# Altium schematic sheet Converter_Unit.SchDoc
size A3
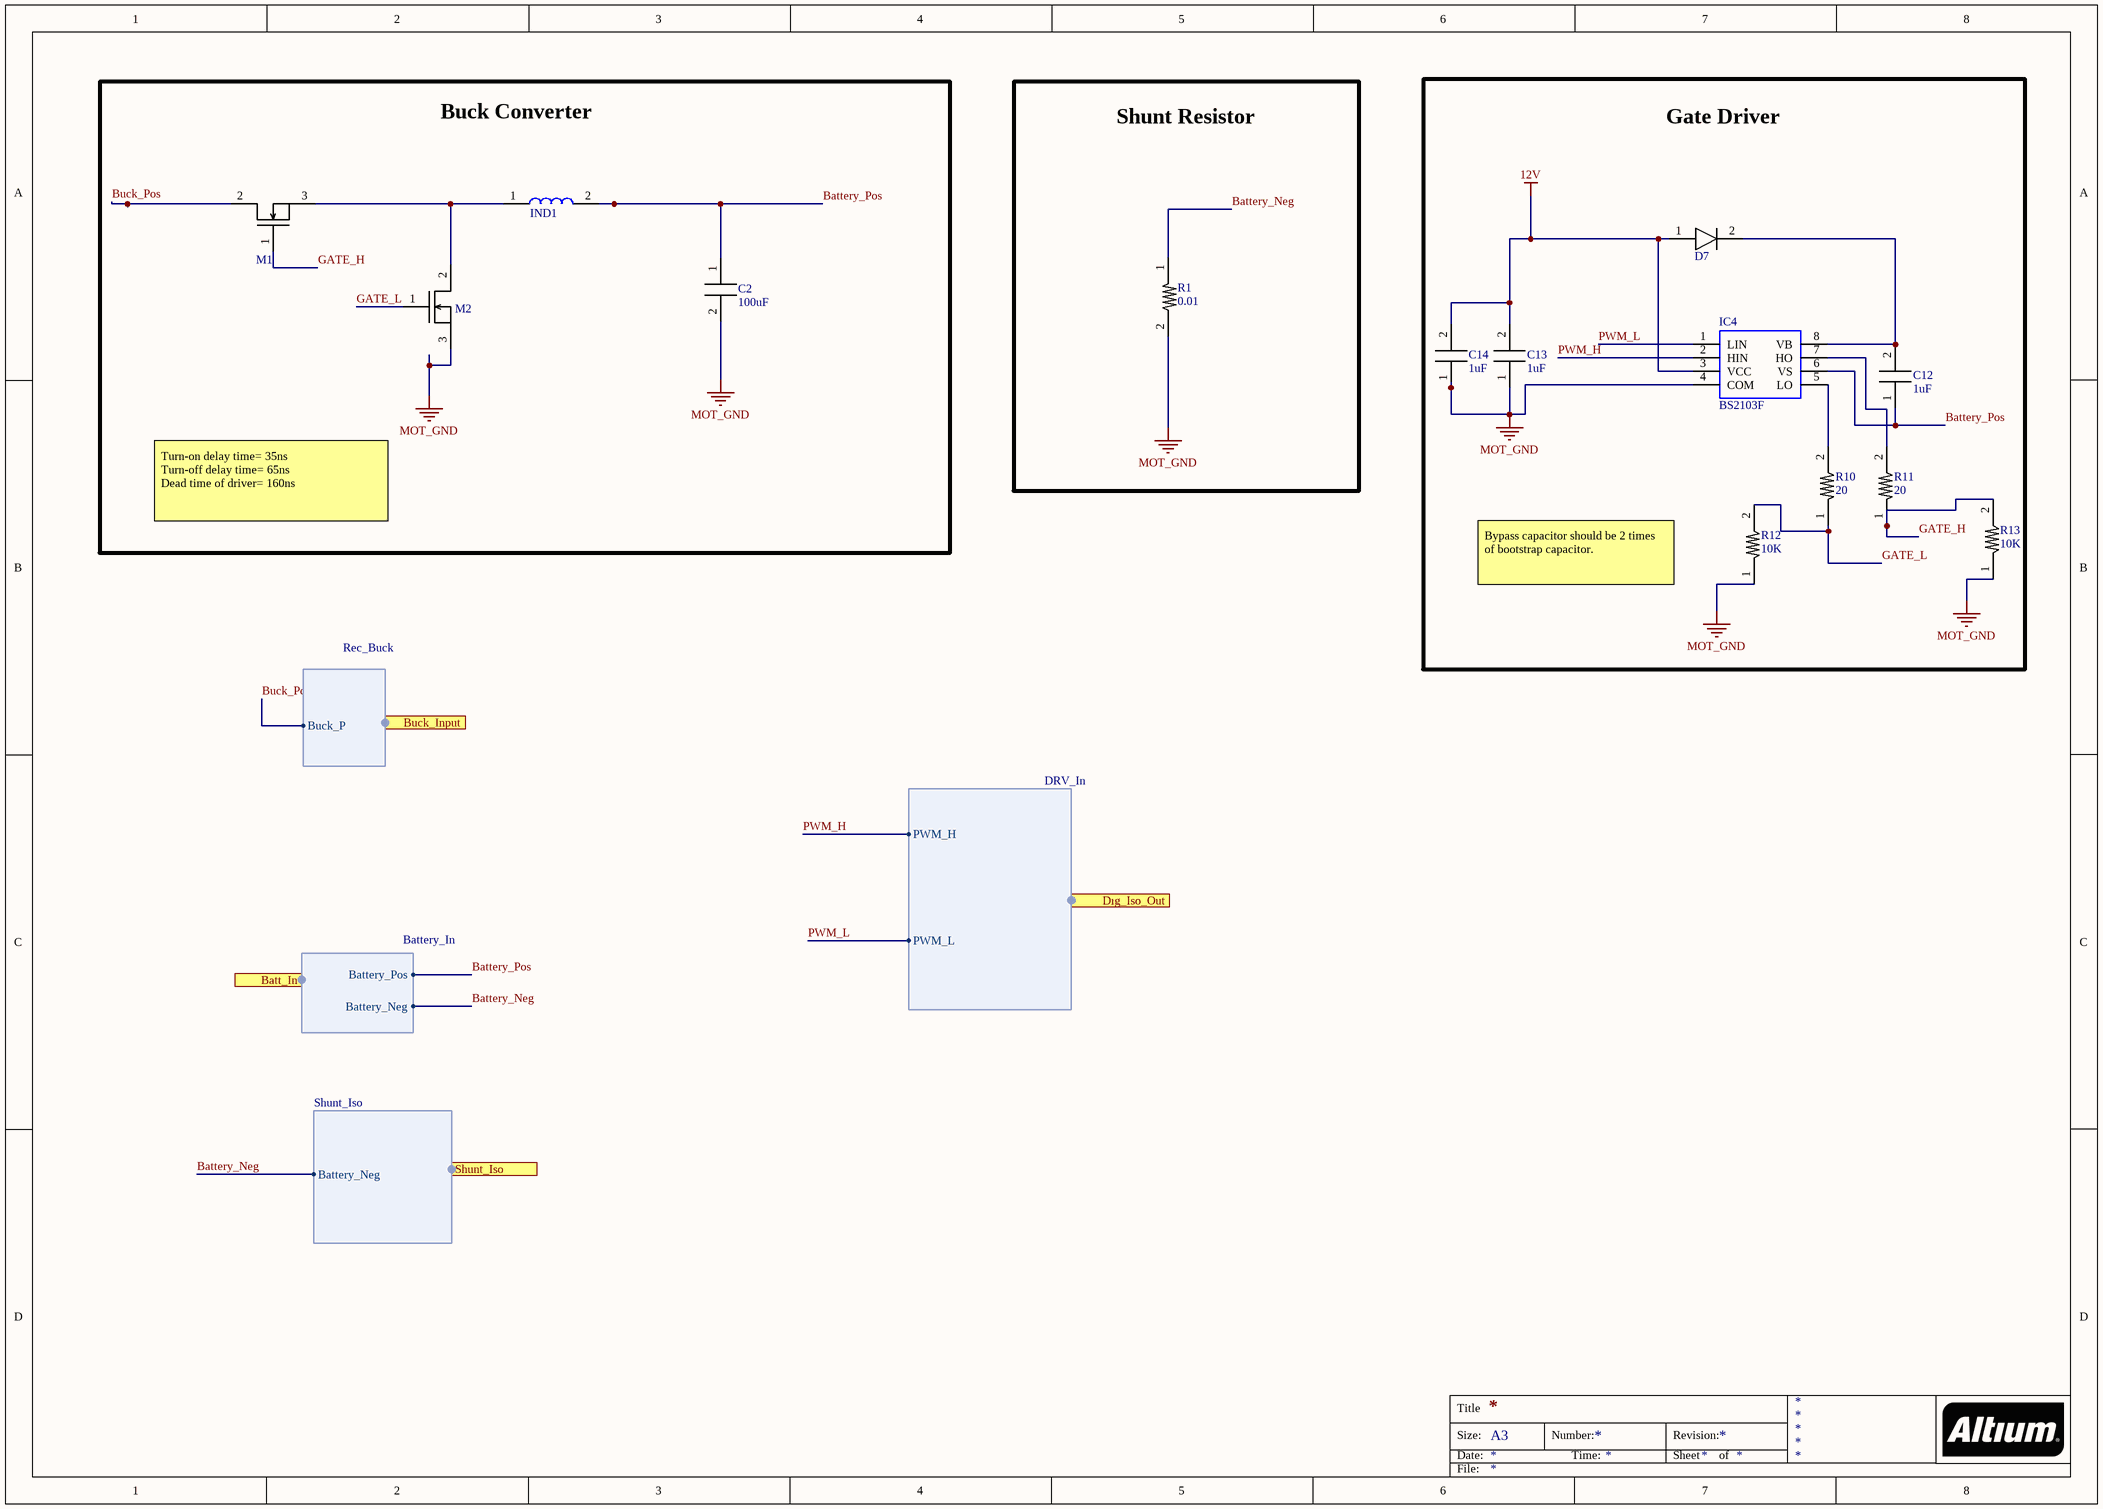
[diagram p0: Converter_Unit.SchDoc]

## Parts
C2  Parameter 1: 100uF  [860020573008]  (hidden comment: CAP 100uF 860020573008)
C12  Parameter 1: 1uF  [0603_CAP]  (hidden comment: CAP 1uF)
C13  Parameter 1: 1uF  [0603_CAP]  (hidden comment: CAP 1uF)
C14  Parameter 1: 1uF  [0603_CAP]  (hidden comment: CAP 1uF)
D7  DI S2GTR  [S2GTR]  (value not drawn)
IC4  BS2103F  [BS2103F]
IND1  IND, 1mH, B82615B2202M001  [AIRD]  (value not drawn)
M1  M?  [FDD5N50NZ]  (value not drawn)
M2  M?  [FDD5N50NZ]  (value not drawn)
R1  Parameter 1: 0.01  [RES_0402]  (hidden comment: RES, 0.01, 0402, Shunt)
R10  Parameter 1: 20  [0603_RES]  (hidden comment: RES, 20, 0603)
R11  Parameter 1: 20  [0603_RES]  (hidden comment: RES, 20, 0603)
R12  Parameter 1: 10K  [0603_RES]  (hidden comment: RES, 10K, 0603)
R13  Parameter 1: 10K  [0603_RES]  (hidden comment: RES, 10K, 0603)

## Ports
Batt_In (harness Battery_In), Buck_Input (harness Rec_Buck), Dıg_Iso_Out (harness DRV_In), Shunt_Iso (harness Shunt_Iso)

## Harnesses
Battery_In: Battery_Pos, Battery_Neg
DRV_In: PWM_H, PWM_L
Shunt_Iso: Battery_Neg
Rec_Buck: Buck_P

## Nets
12V: C13.2 C14.2 D7.1(Anode) IC4.3(VCC)
MOT_GND: C2.2 C13.1 C14.1 IC4.4(COM) M2.3 R1.2 R12.1 R13.1
Battery_Neg: R1.1 ; port Batt_In.Battery_Neg, port Shunt_Iso.Battery_Neg
Battery_Pos: C2.1 C12.1 IC4.6(VS) IND1.2 ; port Batt_In.Battery_Pos
Buck_Pos: M1.2 ; port Buck_Input.Buck_P
GATE_H: M1.1 R11.1 R13.2
GATE_L: M2.1 R10.1 R12.2
PWM_H: IC4.2(HIN) ; port Dıg_Iso_Out.PWM_H
PWM_L: IC4.1(LIN) ; port Dıg_Iso_Out.PWM_L
NetC12_2: C12.2 D7.2(Cathode) IC4.8(VB)
NetIC4_5: IC4.5(LO) R10.2
NetIC4_7: IC4.7(HO) R11.2
NetIND1_1: IND1.1 M1.3 M2.2

## Notes on the sheet
- Buck Converter
- Shunt Resistor
- Gate Driver
- Turn-on delay time= 35ns
  Turn-off delay time= 65ns
  Dead time of driver= 160ns
- Bypass capacitor should be 2 times of bootstrap capacitor.
- Title
- Size:
- Date:
- A3
- Number:
- Time:
- Revision:
- Sheet
- of
- File:

## Library data of the parts
D7 = DI S2GTR: DI, S2GTR, 400V, 2A
IC4 = IC DRV, HALF-B, BS2103F
IND1 = IND, 1mH, B82615B2202M001: IND, 5mH, B82615B2202M001, 250V, 2A
M1 M2 = MOS, N-CH, FDD5N550NZ: MOS, N-CH, FDD5N550NZ, 2A
R1 = RES, 0.01, 0402, Shunt: RES, 0.01, 0402, Shunt, CSS0402FT10L0